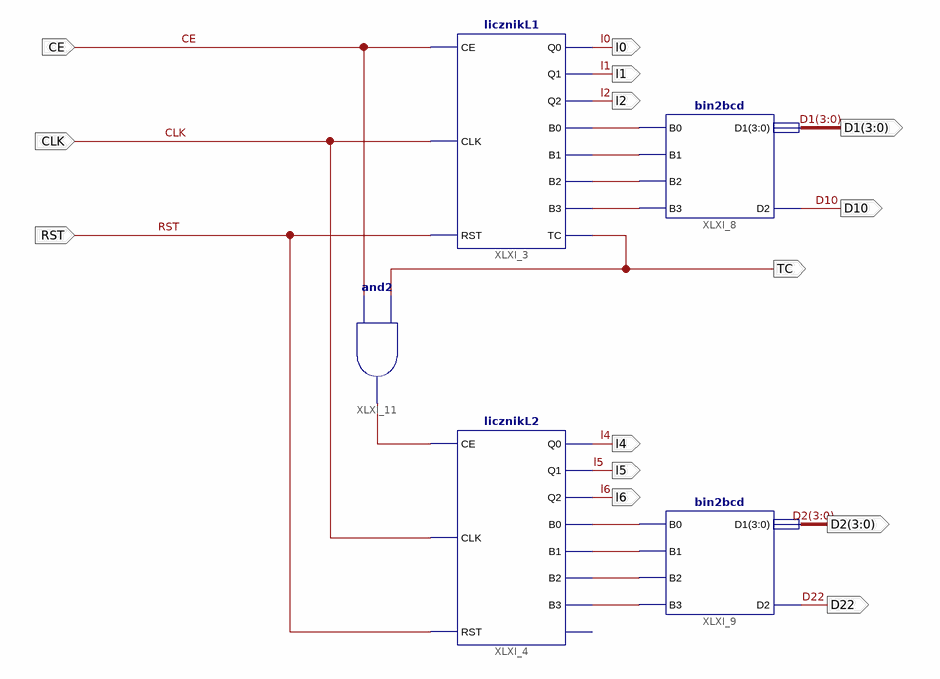
[diagram p0: schematic sheet 1]
// Xilinx ISE schematic symulacja.sch (spartan3e) as structural Verilog: 5 symbols, 14 ports
module symulacja (
  input  CE,
  input  RST,
  input  CLK,
  output TC,
  output l2,
  output l1,
  output l0,
  output [3:0] D1,
  output D10,
  output l4,
  output l5,
  output l6,
  output [3:0] D2,
  output D22
);

  wire XLXN_13, XLXN_14, XLXN_15, XLXN_16, XLXN_17, XLXN_18, XLXN_19, XLXN_20, XLXN_49;

  licznikL1 XLXI_3 (
    .CE(CE), .CLK(CLK), .RST(RST), .Q0(l0), .Q1(l1), .Q2(l2), .B3(XLXN_17), .B1(XLXN_19), .B0(XLXN_20),
    .B2(XLXN_18), .TC(TC));
  bin2bcd XLXI_9 (.D1(D2), .B0(XLXN_13), .B1(XLXN_14), .B2(XLXN_15), .B3(XLXN_16), .D2(D22));
  bin2bcd XLXI_8 (.D1(D1), .B0(XLXN_20), .B1(XLXN_19), .B2(XLXN_18), .B3(XLXN_17), .D2(D10));
  licznikL2 XLXI_4 (
    .CE(XLXN_49), .CLK(CLK), .RST(RST), .B1(XLXN_14), .B0(XLXN_13), .B2(XLXN_15), .B3(XLXN_16), .Q2(l6),
    .Q1(l5), .Q0(l4));  // open: TC
  and XLXI_11 (XLXN_49, CE, TC);
endmodule
